# Altium schematic sheet 3_InfoPerif.SchDoc
size 414 x 293 mm; SheetNumber: 3; SheetTotal: 4
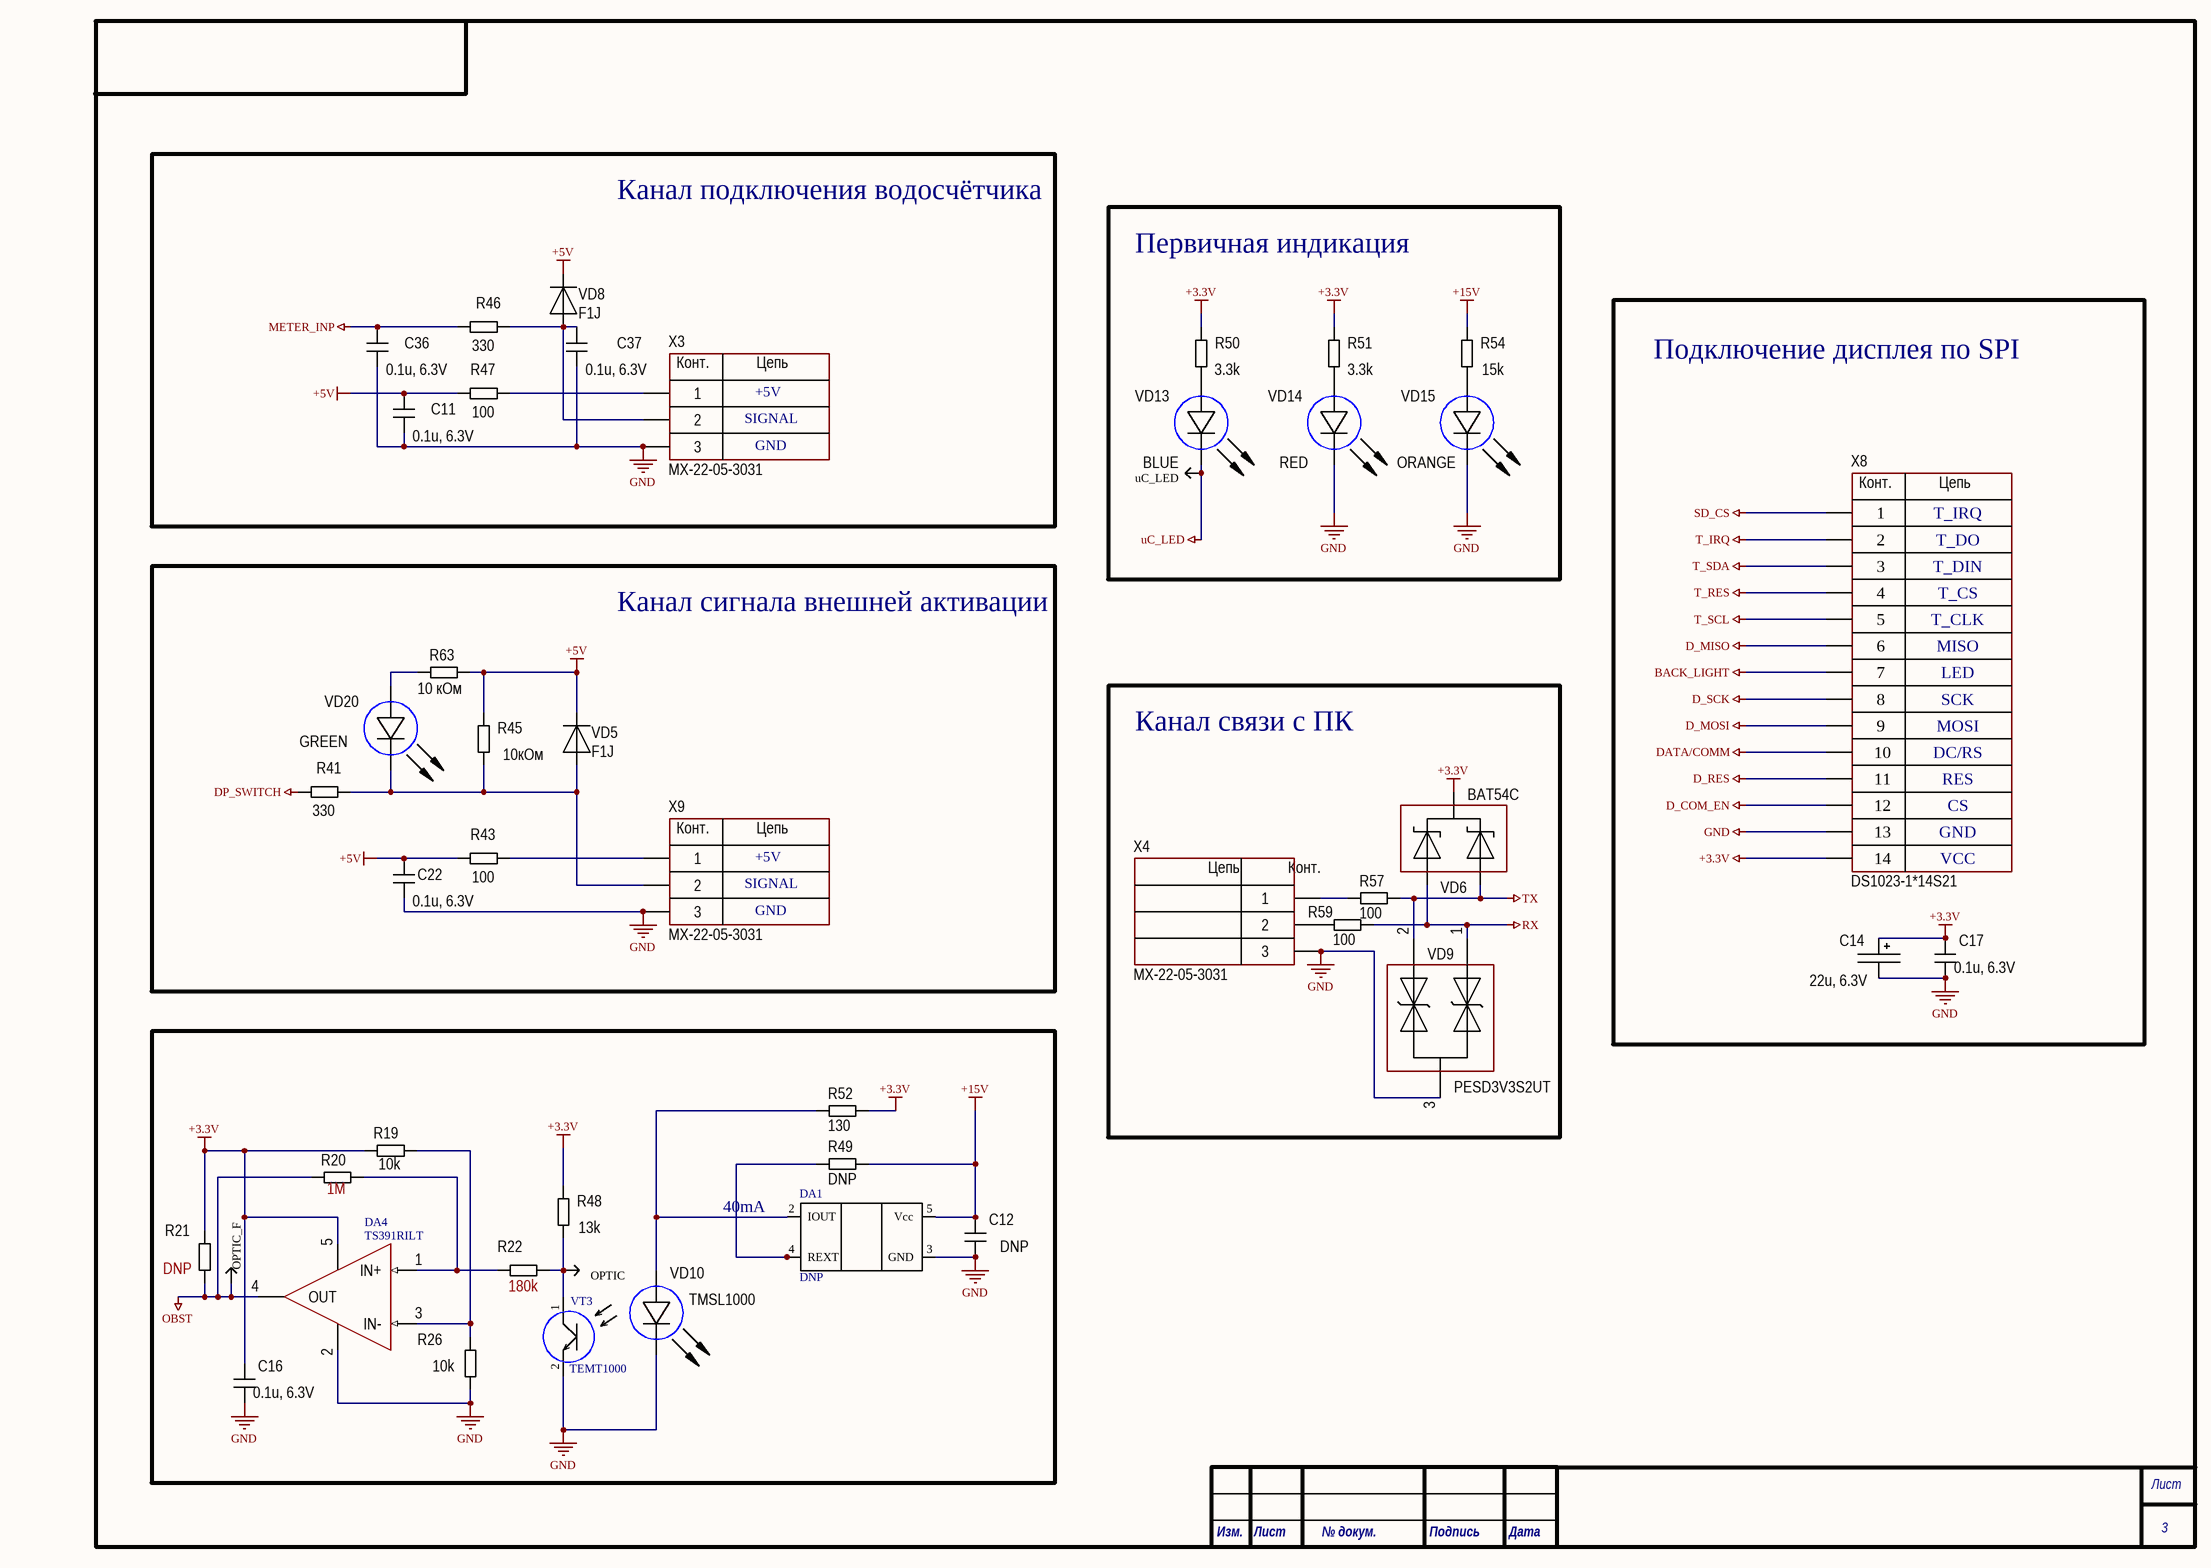
[diagram p0: 3_InfoPerif.SchDoc]

## Parts
C11  0.1u, 6.3V  [CH0603C]
C12  DNP  [CH0402C]
C14  22u, 6.3V  [TANTAL_A]
C16  0.1u, 6.3V  [CH0402C]
C17  0.1u, 6.3V  [CH0402C]
C22  0.1u, 6.3V  [CH0402C]
C36  0.1u, 6.3V  [CH0402C]
C37  0.1u, 6.3V  [CH0402C]
DA1  DNP  [SOT353]
DA4  TS391RILT  [SOT23-5]
OPTIC  (no value)  [TestPoint]
OPTIC_F  (no value)  [TestPoint]
R19  10k  [CH0402R]
R20  1M  [CH0402R]
R21  DNP  [CH0402R]
R22  180k  [CH0402R]
R26  10k  [CH0402R]
R41  330  [CH0402R]
R43  100  [CH0805R]
R45  10кОм  [CH0603R]
R46  330  [CH0402R]
R47  100  [CH0805R]
R48  13k  [CH0402R]
R49  DNP  [CH0805R]
R50  3.3k  [CH0805R]
R51  3.3k  [CH0805R]
R52  130  [CH0805R]
R54  15k  [CH0805R]
R57  100  [CH0402R]
R59  100  [CH0402R]
R63  10 кОм  [CH0805R]
uC_LED  (no value)  [TestPoint]
VD5  F1J  [SOD123F]
VD6  BAT54C  [SOT23_123]
VD8  F1J  [SOD123F]
VD9  PESD3V3S2UT  [SOT23_132]
VD10  TMSL1000  [TSML1000]
VD13  BLUE  [CH0603LB]
VD14  RED  [CH0603LB]
VD15  ORANGE  [CH0603LB]
VD20  GREEN  [CH0603LB]
VT3  TEMT1000  [TEMT1000]
X3  MX-22-05-3031  [CON: MX-22-05-3031]
X4  MX-22-05-3031  [CON: MX-22-05-3031]
X8  DS1023-1*14S21  [DS1024-14]
X9  MX-22-05-3031  [CON: MX-22-05-3031]

## Blocks framed on the sheet
Канал подключения водосчётчика: C11 C36 C37 R46 R47 VD8 X3
Первичная индикация: R50 R51 R54 uC_LED VD13-VD15
Подключение дисплея по SPI: C14 C17 X8
Канал сигнала внешней активации: C22 R41 R43 R45 R63 VD5 VD20 X9
Канал связи с ПК: R57 R59 VD6 VD9 X4
40mA: C12 C16 DA1 DA4 OPTIC OPTIC_F R19-R22 R26 R48 R49 R52 VD10 VT3

## Nets
+3.3V: C14.1 C16.2 C17.2 DA4.5(V+) R19.2 R21.2 R48.2 R50.2 R51.2 R52.2 VD6.2 X8.14
+5V: C11.2 C22.2 R43.1 R45.1 R47.1 R63.2 VD5.2 VD8.2
+15V: C12.2 DA1.5(Vcc) R49.2 R54.2
BACK_LIGHT: X8.7
D_COM_EN: X8.12
D_MISO: X8.6
D_MOSI: X8.9
D_RES: X8.11
D_SCK: X8.8
DATA/COMM: X8.10
DP_SWITCH: R41.1
GND: C11.1 C12.1 C14.2 C16.1 C17.1 C22.1 C36.1 C37.1 DA1.3(GND) DA4.2(V-) R26.1 VD9.3 VD10.2(C) VD14.2(C) VD15.2(C) VT3.2 X3.3 X4.3 X8.13 X9.3
METER_INP: C36.2 R46.1
OBST: DA4.4(OUT) OPTIC_F.0 R20.2 R21.1
RX: R59.2 VD6.3 VD9.1
SD_CS: X8.1
T_IRQ: X8.2
T_RES: X8.4
T_SCL: X8.5
T_SDA: X8.3
TX: R57.2 VD6.1 VD9.2
uC_LED: uC_LED.0 VD13.2(C)
NetC37_2: C37.2 R46.2 VD8.1 X3.2
NetDA1_2: DA1.2(IOUT) R52.1 VD10.1(A)
NetDA1_4: DA1.4(REXT) R49.1
NetDA4_1: DA4.1(IN+) R20.1 R22.2
NetDA4_3: DA4.3(IN-) R19.1 R26.2
NetOPTIC_0: OPTIC.0 R22.1 R48.1 VT3.1
NetR41_2: R41.2 R45.2 VD5.1 VD20.2(C) X9.2
NetR43_2: R43.2 X9.1
NetR47_2: R47.2 X3.1
NetR50_1: R50.1 VD13.1(A)
NetR51_1: R51.1 VD14.1(A)
NetR54_1: R54.1 VD15.1(A)
NetR57_1: R57.1 X4.1
NetR59_1: R59.1 X4.2
NetR63_1: R63.1 VD20.1(A)

## Notes on the sheet
- SIGNAL
- +5V
- GND
- T_IRQ
- T_DO
- T_DIN
- T_CS
- T_CLK
- MISO
- LED
- SCK
- MOSI
- DC/RS
- RES
- CS
- VCC
- Лист
- Изм.
- № докум.
- Подпись
- Дата
- (in symbol 3-Connector) Цепь; Конт.
- (in symbol 14-Connector) Конт.; Цепь

## Library data of the parts
C11 = Capacitor: 0805; Model: 06035C104KAT2A; Manufacturer: *; HelpURL: *; ComponentKind: *; Value: *
C12 = Capacitor: 0805; Manufacturer: *; Model: DNP; HelpURL: *; ComponentKind: *; Value: DNP
C14 = TantalCap: Model: T494A226M010AT; Manufacturer: *; HelpURL: *; ComponentKind: *; Value: *
C16 C22 C36 C37 = Capacitor: 0805; Model: CC0402KRX7R5BB104; Manufacturer: *; HelpURL: *; ComponentKind: *; Value: *
C17 = Capacitor: Model: CC0402KRX7R5BB104; Manufacturer: *; HelpURL: *; ComponentKind: *; Value: *
DA1 = PSSI2021SAY: Iout = 0.617/Rext + 15 µA; Model: DNP
DA4 = LMV331M5: SOT23-5; Model: TS391RILT
OPTIC OPTIC_F uC_LED = TestPoint: Model: DNP
R19 R26 = Resistor: Model: AC0402FR-0710KL; Manufacturer: *; HelpURL: *; ComponentKind: *; Value: *
R20 = Resistor: Model: AC0402FR-071ML; Manufacturer: *; HelpURL: *; ComponentKind: *; Value: *
R21 = Resistor: Manufacturer: *; Model: DNP; HelpURL: *; ComponentKind: *; Value: DNP
R22 = Resistor: Model: AC0402FR-07180KL; Manufacturer: *; HelpURL: *; ComponentKind: *; Value: *
R41 R46 = Resistor: Model: RC0402FR-07330RL; Manufacturer: *; HelpURL: *; ComponentKind: *; Value: *
R43 R47 = Resistor: Model: AC0805FR-7W100RL; Manufacturer: *; HelpURL: *; ComponentKind: *; Value: *
R45 = Resistor: Model: AC0603FR-0710KL; Manufacturer: *; HelpURL: *; ComponentKind: *; Value: *
R48 = Resistor: 0805; Model: AC0402FR-0713KL; Manufacturer: *; HelpURL: *; ComponentKind: *; Value: *
R49 = Resistor: 0805; Manufacturer: *; Model: DNP; HelpURL: *; ComponentKind: *; Value: DNP
R50 R51 = Resistor: Model: AC0805FR-073K3L; Manufacturer: *; HelpURL: *; ComponentKind: *; Value: *
R52 = Resistor: 0805; Model: AC0805FR-7W130RL; Manufacturer: *; HelpURL: *; ComponentKind: *; Value: 130
R54 = Resistor: Model: AC0805FR-0715KL; Manufacturer: *; HelpURL: *; ComponentKind: *; Value: *
R57 R59 = Resistor: Model: AC0402FR-07100RL; Manufacturer: *; HelpURL: *; ComponentKind: *; Value: *
R63 = Resistor: Model: AC0805FR-0710K5L; Manufacturer: *; HelpURL: *; ComponentKind: *; Value: *
VD5 VD8 = Diod: ComponentKind: *; Manufacturer: *; Model: F1J; HelpURL: *
VD6 = Diod Schottky Array v.1: ComponentKind: *; Manufacturer: *; Model: BAT54C; HelpURL: *
VD9 = TVS Array: ComponentKind: *; Manufacturer: *; Model: PESD3V3S2UT; HelpURL: *
VD10 = LED_1: Manufacturer: *; Model: TMSL1000; HelpURL: *; ComponentKind: *; Value: *
VD13 = LED_1: Model: B1911NB; Manufacturer: *; HelpURL: *; ComponentKind: *; Value: *
VD14 = LED_1: Model: B1911USD; Manufacturer: *; HelpURL: *; ComponentKind: *; Value: *
VD15 = LED_1: Model: B1911UD; Manufacturer: *; HelpURL: *; ComponentKind: *; Value: *
VD20 = LED_1: Model: B1911NG; Manufacturer: *; HelpURL: *; ComponentKind: *; Value: *
X3 X4 X9 = 3-Connector: Model: MX-22-05-3031; Manufacturer: *; HelpURL: *; ComponentKind: *
X8 = 14-Connector: Model: DS1023-1*14S21; Manufacturer: *; HelpURL: *; ComponentKind: *
VT3 = TEMT1000: Model: TEMT1000